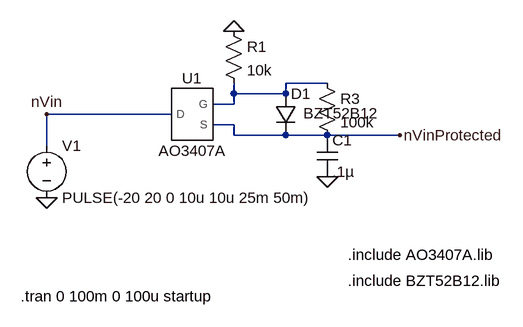
[diagram p0: schematic ReversePolarityProtection.asc]
ReversePolarityProtection.asc, the LTspice schematic file:
Version 4
SHEET 1 880 916
WIRE 384 96 320 96
WIRE 240 112 240 96
WIRE 320 112 320 96
WIRE 320 112 240 112
WIRE 240 128 240 112
WIRE 240 128 208 128
WIRE 144 144 -48 144
WIRE 240 160 208 160
WIRE 240 176 240 160
WIRE 320 176 240 176
WIRE 384 176 320 176
WIRE 496 176 384 176
WIRE -48 192 -48 144
FLAG -48 144 nVin
FLAG 496 176 nVinProtected
FLAG 240 16 0
FLAG -48 272 0
FLAG 384 240 0
SYMBOL voltage -48 176 R0
WINDOW 123 0 0 Left 0
WINDOW 39 24 124 Left 2
SYMATTR InstName V1
SYMATTR Value PULSE(-20 20 0 10u 10u 25m 50m)
SYMBOL AO3407A 176 144 R0
SYMATTR InstName U1
SYMBOL diode 304 112 R0
WINDOW 3 43 30 Left 2
SYMATTR Value BZT52B12
SYMATTR InstName D1
SYMBOL res 224 0 R0
SYMATTR InstName R1
SYMATTR Value 10k
SYMBOL cap 368 176 R0
SYMATTR InstName C1
SYMATTR Value .1µ
SYMBOL res 368 80 R0
SYMATTR InstName R3
SYMATTR Value 100k
TEXT 416 360 Left 2 !.include AO3407A.lib
TEXT 416 400 Left 2 !.include BZT52B12.lib
TEXT -88 424 Left 2 !.tran 0 100m 0 100u startup

The netlist it stands for:
* ReversePolarityProtection.asc
V1 nVin 0 PULSE(-20 20 0 10u 10u 25m 50m)
XU1 nVin N001 nVinProtected AO3407A  ; pins D G S
D1 N001 nVinProtected BZT52B12
R1 0 N001 10k
C1 nVinProtected 0 .1µ
R3 N001 nVinProtected 100k
.model D D
.lib standard.dio
.include AO3407A.lib
.include BZT52B12.lib
.tran 0 100m 0 100u startup
.lib C:\Users\jason\OneDrive\Documents\GitHub\BowelProbe\LTspiceSim\AO3407A.lib
.backanno
.end